# Altium schematic sheet [01] Connectors.SchDoc
size A4
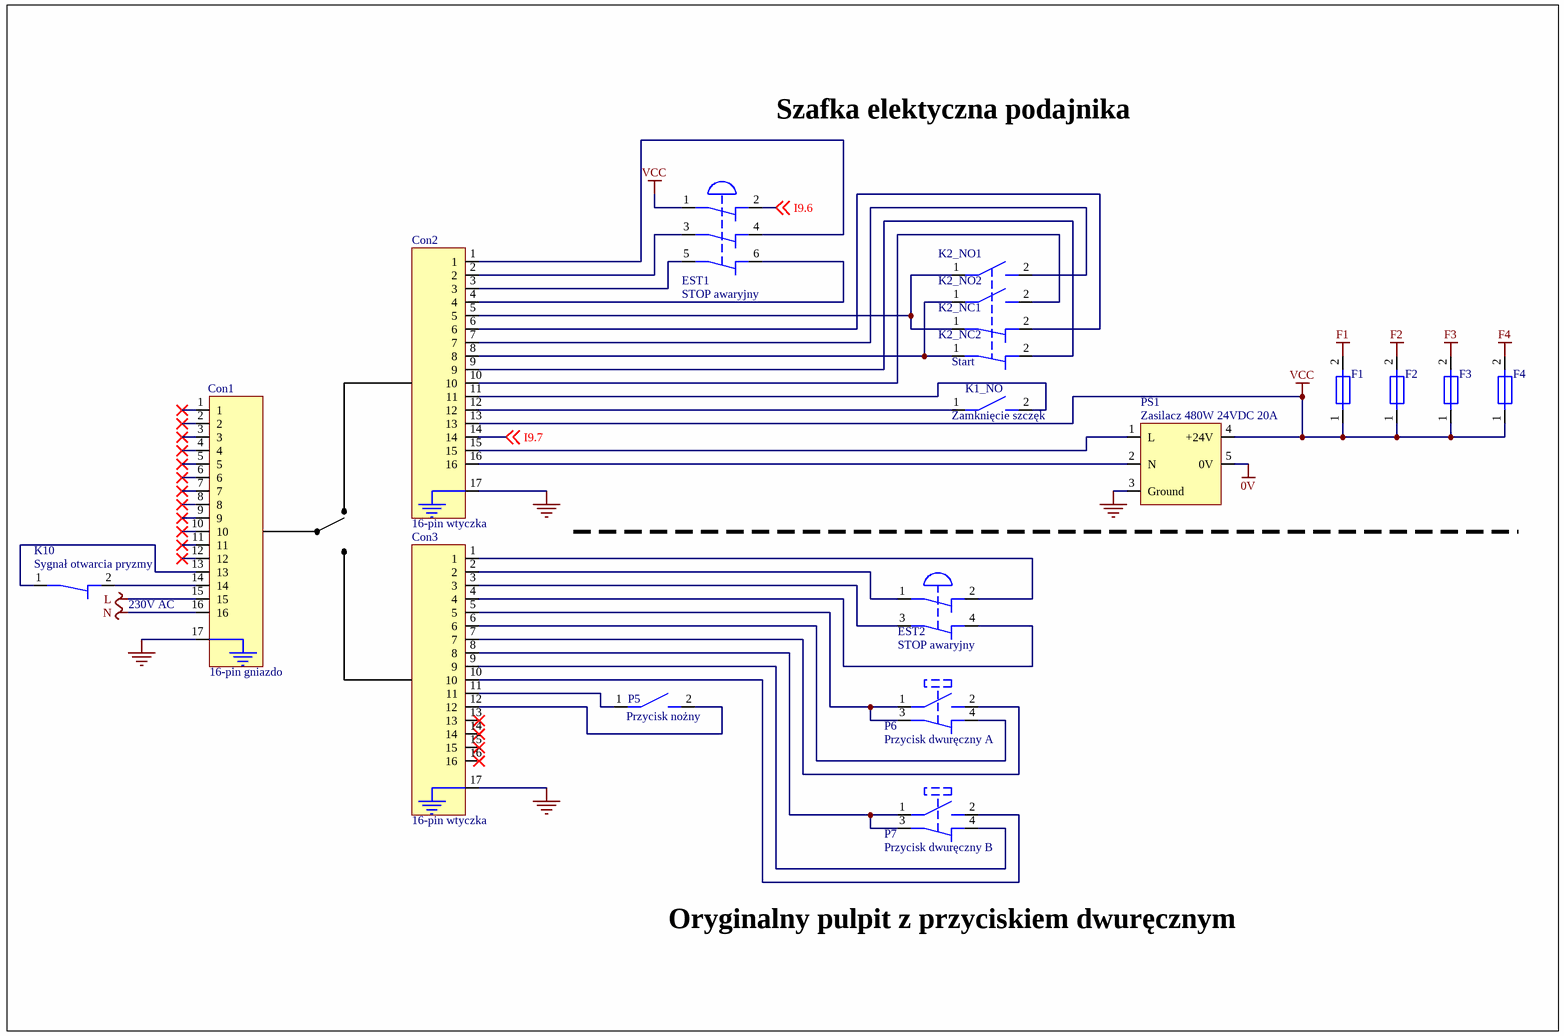
[diagram p0: [01] Connectors.SchDoc]

## Parts
Con1  16-pin gniazdo
Con2  16-pin wtyczka
Con3  16-pin wtyczka
EST1  STOP awaryjny
EST2  STOP awaryjny
F1  ?A  (value not drawn)
F2  ?A  (value not drawn)
F3  ?A  (value not drawn)
F4  ?A  (value not drawn)
K1_NO  Zamknięcie szczęk
K2_NC1  NC  (value not drawn)
K2_NC2  NC  (value not drawn)
K2_NO1  Start
K2_NO2  NO  (value not drawn)
K10  Sygnał otwarcia pryzmy
P5  Przycisk nożny
P6  Przycisk dwuręczny A
P7  Przycisk dwuręczny B
PS1  Zasilacz 480W 24VDC 20A

## Nets
0V: PS1.5(0V)
F1: F1.2
F2: F2.2
F3: F3.2
F4: F4.2
GND: Con1.17 Con2.17(Ground) Con3.17(Ground) PS1.3(Ground)
L: Con1.15
N: Con1.16
VCC: Con2.13 EST1.1 F1.1 F2.1 F3.1 F4.1 PS1.4(+24V)
I9.6: EST1.2 ; off-sheet I9.6
I9.7: Con2.14 ; off-sheet I9.7
NetCon1_13: Con1.13 K10.1
NetCon1_14: Con1.14 K10.2
NetCon2_1: Con2.1 EST1.4
NetCon2_2: Con2.2 EST1.3
NetCon2_3: Con2.3 EST1.5
NetCon2_4: Con2.4 EST1.6
NetCon2_5: Con2.5 K2_NC1.1 K2_NO1.1
NetCon2_6: Con2.6 K2_NC1.2
NetCon2_7: Con2.7 K2_NO1.2
NetCon2_8: Con2.8 K2_NC2.1 K2_NO2.1
NetCon2_9: Con2.9 K2_NC2.2
NetCon2_10: Con2.10 K2_NO2.2
NetCon2_11: Con2.11 K1_NO.2
NetCon2_12: Con2.12 K1_NO.1
NetCon2_15: Con2.15 PS1.1(L)
NetCon2_16: Con2.16 PS1.2(N)
NetCon3_1: Con3.1 EST2.2
NetCon3_2: Con3.2 EST2.1
NetCon3_3: Con3.3 EST2.3
NetCon3_4: Con3.4 EST2.4
NetCon3_5: Con3.5 P6.1 P6.3
NetCon3_6: Con3.6 P6.4
NetCon3_7: Con3.7 P6.2
NetCon3_8: Con3.8 P7.1 P7.3
NetCon3_9: Con3.9 P7.4
NetCon3_10: Con3.10 P7.2
NetCon3_11: Con3.11 P5.1
NetCon3_12: Con3.12 P5.2

Not connected (* = marked no-connect by the designer): Con1 1* 2* 3* 4* 5* 6* 7* 8* 9* 10* 11* 12*; Con3 13* 14* 15* 16*

## Notes on the sheet
- Szafka elektyczna podajnika
- 230V AC
- Oryginalny pulpit z przyciskiem dwuręcznym

## Library data of the parts
Con1 = 16-pin in connector
Con2 Con3 = 16-pin out connector
EST1 = E-STOP 3 line
EST2 = E-STOP 2 line
F1-F4 = Fuse
K1_NO K2_NO1 P5 = NO
K10 = NC
P6 P7 = Button NO+NC
PS1 = Power supply